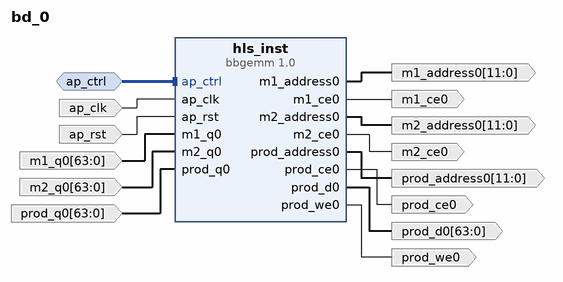
[diagram p0: block diagram of the top level]
# Vivado block design bd_0, xcu50-fsvh2104-2-e, Vivado 2023.2
create_bd_design bd_0

create_bd_intf_port -mode Slave -vlnv xilinx.com:interface:acc_handshake_rtl:1.0 ap_ctrl
create_bd_port -dir I -type clk ap_clk
set_property -dict {CONFIG.FREQ_HZ 125000000.0} [get_bd_ports ap_clk]
create_bd_port -dir I -type rst ap_rst
set_property -dict {CONFIG.POLARITY ACTIVE_HIGH} [get_bd_ports ap_rst]
create_bd_port -dir O -from 11 -to 0 -type data m1_address0
create_bd_port -dir O m1_ce0
create_bd_port -dir I -from 63 -to 0 -type data m1_q0
create_bd_port -dir O -from 11 -to 0 -type data m2_address0
create_bd_port -dir O m2_ce0
create_bd_port -dir I -from 63 -to 0 -type data m2_q0
create_bd_port -dir O -from 11 -to 0 -type data prod_address0
create_bd_port -dir O prod_ce0
create_bd_port -dir O -from 63 -to 0 -type data prod_d0
create_bd_port -dir I -from 63 -to 0 -type data prod_q0
create_bd_port -dir O prod_we0

create_bd_cell -type ip -vlnv xilinx.com:hls:bbgemm:1.0 hls_inst

# ---- connections ----

connect_bd_intf_net -intf_net ap_ctrl_0_1 [get_bd_intf_ports ap_ctrl] [get_bd_intf_pins hls_inst/ap_ctrl]
connect_bd_net -net ap_clk_0_1 [get_bd_ports ap_clk] [get_bd_pins hls_inst/ap_clk]
connect_bd_net -net ap_rst_0_1 [get_bd_ports ap_rst] [get_bd_pins hls_inst/ap_rst]
connect_bd_net [get_bd_pins hls_inst/m1_address0] [get_bd_ports m1_address0]
connect_bd_net [get_bd_pins hls_inst/m1_ce0] [get_bd_ports m1_ce0]
connect_bd_net [get_bd_pins hls_inst/m2_address0] [get_bd_ports m2_address0]
connect_bd_net [get_bd_pins hls_inst/m2_ce0] [get_bd_ports m2_ce0]
connect_bd_net [get_bd_pins hls_inst/prod_address0] [get_bd_ports prod_address0]
connect_bd_net [get_bd_pins hls_inst/prod_ce0] [get_bd_ports prod_ce0]
connect_bd_net [get_bd_pins hls_inst/prod_d0] [get_bd_ports prod_d0]
connect_bd_net [get_bd_pins hls_inst/prod_we0] [get_bd_ports prod_we0]
connect_bd_net -net m1_q0_0_1 [get_bd_ports m1_q0] [get_bd_pins hls_inst/m1_q0]
connect_bd_net -net m2_q0_0_1 [get_bd_ports m2_q0] [get_bd_pins hls_inst/m2_q0]
connect_bd_net -net prod_q0_0_1 [get_bd_ports prod_q0] [get_bd_pins hls_inst/prod_q0]

validate_bd_design
save_bd_design
